# Altium schematic sheet DSP.SchDoc: DSP Interface
size 431 x 254 mm; Engineer: Prasoon Sinha; DocumentNumber: 2; SheetNumber: 2; SheetTotal: 26
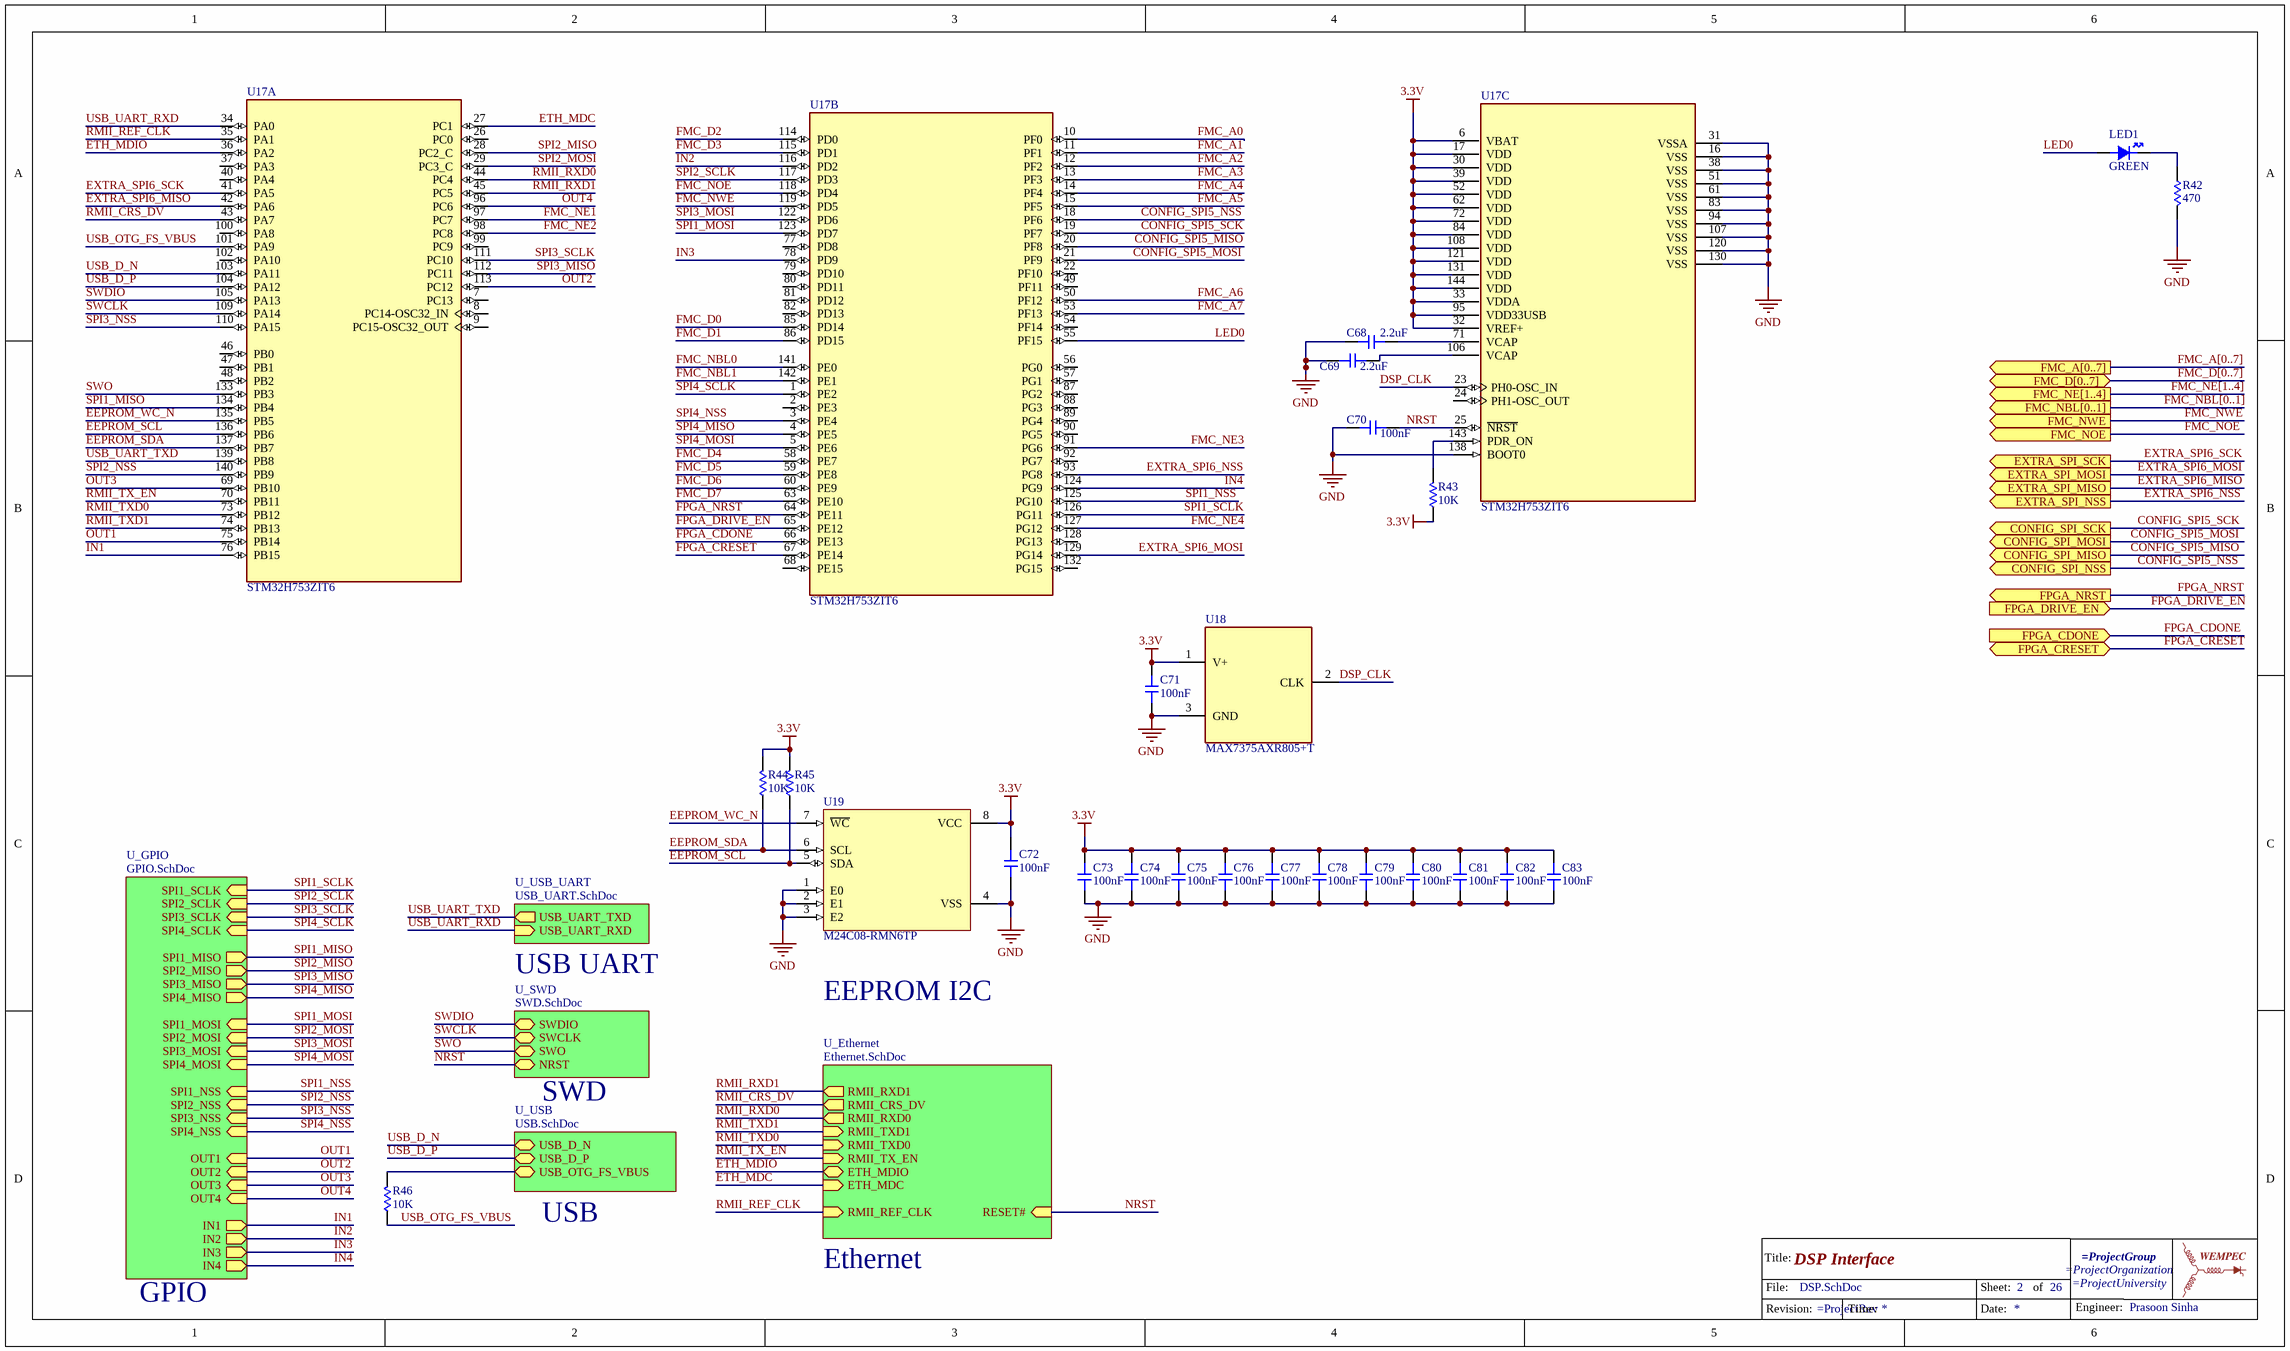
[diagram p0: DSP.SchDoc]

## Parts
*?  TitleBlockWEMPEC  (value not drawn)  (graphical)
C68  value 2.2uF  [0603-CAP]  (hidden comment: Capacitor)
C69  value 2.2uF  [0603-CAP]  (hidden comment: Capacitor)
C70  value 100nF  [0603-CAP]  (hidden comment: Capacitor)
C71  value 100nF  [0603-CAP]  (hidden comment: Capacitor)
C72  value 100nF  [0603-CAP]  (hidden comment: Capacitor)
C73  value 100nF  [0603-CAP]  (hidden comment: Capacitor)
C74  value 100nF  [0603-CAP]  (hidden comment: Capacitor)
C75  value 100nF  [0603-CAP]  (hidden comment: Capacitor)
C76  value 100nF  [0603-CAP]  (hidden comment: Capacitor)
C77  value 100nF  [0603-CAP]  (hidden comment: Capacitor)
C78  value 100nF  [0603-CAP]  (hidden comment: Capacitor)
C79  value 100nF  [0603-CAP]  (hidden comment: Capacitor)
C80  value 100nF  [0603-CAP]  (hidden comment: Capacitor)
C81  value 100nF  [0603-CAP]  (hidden comment: Capacitor)
C82  value 100nF  [0603-CAP]  (hidden comment: Capacitor)
C83  value 100nF  [0603-CAP]  (hidden comment: Capacitor)
LED1  value GREEN  [0603-LED]  (hidden comment: LED)
R42  value 470  [0603-RES]  (hidden comment: Resistor)
R43  value 10K  [0603-RES]  (hidden comment: Resistor)
R44  value 10K  [0603-RES]  (hidden comment: Resistor)
R45  value 10K  [0603-RES]  (hidden comment: Resistor)
R46  value 10K  [0603-RES]  (hidden comment: Resistor)
U17  STM32H753ZIT6  [QFP50P2200X2200X160-144N]  (parts A,B,C of 3)
U18  MAX7375AXR805+T  [SOT65P210X110-3N]
U19  M24C08-RMN6TP  [SOIC127P600X175-8N]

## Sub-sheets
U_Ethernet = Ethernet.SchDoc: RMII_RXD1 (out), RMII_CRS_DV (out), RMII_RXD0 (out), RMII_TXD1 (in), RMII_TXD0 (in), RMII_TX_EN (in), ETH_MDIO (bidir), ETH_MDC (in), RESET# (in), RMII_REF_CLK (in)
U_GPIO = GPIO.SchDoc: IN1 (out), IN3 (out), IN4 (out), OUT2 (in), OUT4 (in), OUT3 (in), OUT1 (in), IN2 (out), SPI4_MISO (out), SPI2_SCLK (in), SPI2_MISO (out), SPI1_SCLK (in), SPI1_MISO (out), SPI4_NSS (in), SPI2_NSS (in), SPI1_MOSI (in), SPI3_MOSI (in), SPI4_MOSI (in), SPI3_MISO (out), SPI3_SCLK (in), SPI1_NSS (in), SPI2_MOSI (in), SPI4_SCLK (in), SPI3_NSS (in)
U_SWD = SWD.SchDoc: NRST (bidir), SWO (bidir), SWCLK (bidir), SWDIO (bidir)
U_USB = USB.SchDoc: USB_D_N (bidir), USB_D_P (bidir), USB_OTG_FS_VBUS (bidir)
U_USB_UART = USB_UART.SchDoc: USB_UART_RXD (in), USB_UART_TXD (out)

## Ports
CONFIG_SPI_MISO (out), CONFIG_SPI_MOSI (out), CONFIG_SPI_NSS (out), CONFIG_SPI_SCK (out), EXTRA_SPI_MISO (out), EXTRA_SPI_MOSI (out), EXTRA_SPI_NSS (out), EXTRA_SPI_SCK (out), FMC_A[0..7] (out), FMC_D[0..7] (bidir), FMC_NBL[0..1] (out), FMC_NE[1..4] (out), FMC_NOE (out), FMC_NWE (out), FPGA_CDONE (in), FPGA_CRESET (bidir), FPGA_DRIVE_EN (in), FPGA_NRST (out)

## Nets
3.3V: C71.2 C72.2 C73.2 C74.2 C75.2 C76.2 C77.2 C78.2 C79.2 C80.2 C81.2 C82.2 C83.2 R43.1 R44.2 R45.2 U17.6(VBAT) U17.17(VDD) U17.30(VDD) U17.32(VREF+) U17.33(VDDA) U17.39(VDD) U17.52(VDD) U17.62(VDD) U17.72(VDD) U17.84(VDD) U17.95(VDD33USB) U17.108(VDD) U17.121(VDD) U17.131(VDD) U17.144(VDD) U18.1(V+) U19.8(VCC)
GND: C68.2 C69.2 C70.2 C71.1 C72.1 C73.1 C74.1 C75.1 C76.1 C77.1 C78.1 C79.1 C80.1 C81.1 C82.1 C83.1 R42.2 U17.16(VSS) U17.31(VSSA) U17.38(VSS) U17.51(VSS) U17.61(VSS) U17.83(VSS) U17.94(VSS) U17.107(VSS) U17.120(VSS) U17.130(VSS) U17.138(BOOT0) U18.3(GND) U19.1(E0) U19.2(E1) U19.3(E2) U19.4(VSS)
CONFIG_SPI5_MISO: U17.20(PF8) ; port CONFIG_SPI_MISO
CONFIG_SPI5_MOSI: U17.21(PF9) ; port CONFIG_SPI_MOSI
CONFIG_SPI5_NSS: U17.18(PF6) ; port CONFIG_SPI_NSS
CONFIG_SPI5_SCK: U17.19(PF7) ; port CONFIG_SPI_SCK
DSP_CLK: U17.23(PH0-OSC_IN) U18.2(CLK)
EEPROM_SCL: R45.1 U17.136(PB6) U19.5(SDA)
EEPROM_SDA: R44.1 U17.137(PB7) U19.6(SCL)
EEPROM_WC_N: U17.135(PB5) U19.7(~{WC})
ETH_MDC: U17.27(PC1) ; sheet U_Ethernet/ETH_MDC
ETH_MDIO: U17.36(PA2) ; sheet U_Ethernet/ETH_MDIO
EXTRA_SPI6_MISO: U17.42(PA6) ; port EXTRA_SPI_MISO
EXTRA_SPI6_MOSI: U17.129(PG14) ; port EXTRA_SPI_MOSI
EXTRA_SPI6_NSS: U17.93(PG8) ; port EXTRA_SPI_NSS
EXTRA_SPI6_SCK: U17.41(PA5) ; port EXTRA_SPI_SCK
FMC_A0: U17.10(PF0)
FMC_A1: U17.11(PF1)
FMC_A2: U17.12(PF2)
FMC_A3: U17.13(PF3)
FMC_A4: U17.14(PF4)
FMC_A5: U17.15(PF5)
FMC_A6: U17.50(PF12)
FMC_A7: U17.53(PF13)
FMC_D0: U17.85(PD14)
FMC_D1: U17.86(PD15)
FMC_D2: U17.114(PD0)
FMC_D3: U17.115(PD1)
FMC_D4: U17.58(PE7)
FMC_D5: U17.59(PE8)
FMC_D6: U17.60(PE9)
FMC_D7: U17.63(PE10)
FMC_NBL0: U17.141(PE0)
FMC_NBL1: U17.142(PE1)
FMC_NE1: U17.97(PC7)
FMC_NE2: U17.98(PC8)
FMC_NE3: U17.91(PG6)
FMC_NE4: U17.127(PG12)
FMC_NOE: U17.118(PD4) ; port FMC_NOE
FMC_NWE: U17.119(PD5) ; port FMC_NWE
FPGA_CDONE: U17.66(PE13) ; port FPGA_CDONE
FPGA_CRESET: U17.67(PE14) ; port FPGA_CRESET
FPGA_DRIVE_EN: U17.65(PE12) ; port FPGA_DRIVE_EN
FPGA_NRST: U17.64(PE11) ; port FPGA_NRST
IN1: U17.76(PB15) ; sheet U_GPIO/IN1
IN2: U17.116(PD2) ; sheet U_GPIO/IN2
IN3: U17.78(PD9) ; sheet U_GPIO/IN3
IN4: U17.124(PG9) ; sheet U_GPIO/IN4
LED0: LED1.A U17.55(PF15)
NRST: C70.1 U17.25(~{NRST}) ; sheet U_SWD/NRST, sheet U_Ethernet/RESET#
OUT1: U17.75(PB14) ; sheet U_GPIO/OUT1
OUT2: U17.113(PC12) ; sheet U_GPIO/OUT2
OUT3: U17.69(PB10) ; sheet U_GPIO/OUT3
OUT4: U17.96(PC6) ; sheet U_GPIO/OUT4
RMII_CRS_DV: U17.43(PA7) ; sheet U_Ethernet/RMII_CRS_DV
RMII_REF_CLK: U17.35(PA1) ; sheet U_Ethernet/RMII_REF_CLK
RMII_RXD0: U17.44(PC4) ; sheet U_Ethernet/RMII_RXD0
RMII_RXD1: U17.45(PC5) ; sheet U_Ethernet/RMII_RXD1
RMII_TX_EN: U17.70(PB11) ; sheet U_Ethernet/RMII_TX_EN
RMII_TXD0: U17.73(PB12) ; sheet U_Ethernet/RMII_TXD0
RMII_TXD1: U17.74(PB13) ; sheet U_Ethernet/RMII_TXD1
SPI1_MISO: U17.134(PB4) ; sheet U_GPIO/SPI1_MISO
SPI1_MOSI: U17.123(PD7) ; sheet U_GPIO/SPI1_MOSI
SPI1_NSS: U17.125(PG10) ; sheet U_GPIO/SPI1_NSS
SPI1_SCLK: U17.126(PG11) ; sheet U_GPIO/SPI1_SCLK
SPI2_MISO: U17.28(PC2_C) ; sheet U_GPIO/SPI2_MISO
SPI2_MOSI: U17.29(PC3_C) ; sheet U_GPIO/SPI2_MOSI
SPI2_NSS: U17.140(PB9) ; sheet U_GPIO/SPI2_NSS
SPI2_SCLK: U17.117(PD3) ; sheet U_GPIO/SPI2_SCLK
SPI3_MISO: U17.112(PC11) ; sheet U_GPIO/SPI3_MISO
SPI3_MOSI: U17.122(PD6) ; sheet U_GPIO/SPI3_MOSI
SPI3_NSS: U17.110(PA15) ; sheet U_GPIO/SPI3_NSS
SPI3_SCLK: U17.111(PC10) ; sheet U_GPIO/SPI3_SCLK
SPI4_MISO: U17.4(PE5) ; sheet U_GPIO/SPI4_MISO
SPI4_MOSI: U17.5(PE6) ; sheet U_GPIO/SPI4_MOSI
SPI4_NSS: U17.3(PE4) ; sheet U_GPIO/SPI4_NSS
SPI4_SCLK: U17.1(PE2) ; sheet U_GPIO/SPI4_SCLK
SWCLK: U17.109(PA14) ; sheet U_SWD/SWCLK
SWDIO: U17.105(PA13) ; sheet U_SWD/SWDIO
SWO: U17.133(PB3) ; sheet U_SWD/SWO
USB_D_N: U17.103(PA11) ; sheet U_USB/USB_D_N
USB_D_P: U17.104(PA12) ; sheet U_USB/USB_D_P
USB_OTG_FS_VBUS: R46.1 U17.101(PA9)
USB_UART_RXD: U17.34(PA0) ; sheet U_USB_UART/USB_UART_RXD
USB_UART_TXD: U17.139(PB8) ; sheet U_USB_UART/USB_UART_TXD
NetC68_1: C68.1 U17.71(VCAP)
NetC69_1: C69.1 U17.106(VCAP)
NetLED1_C: LED1.C R42.1
NetR43_2: R43.2 U17.143(PDR_ON)
NetR46_2: R46.2 ; sheet U_USB/USB_OTG_FS_VBUS

Not connected (* = marked no-connect by the designer): U17 2(PE3) 7(PC13) 8(PC14-OSC32_IN) 9(PC15-OSC32_OUT) 22(PF10) 24(PH1-OSC_OUT) 26(PC0) 37(PA3) 40(PA4) 46(PB0) 47(PB1) 48(PB2) 49(PF11) 54(PF14) 56(PG0) 57(PG1) 68(PE15) 77(PD8) 79(PD10) 80(PD11) 81(PD12) 82(PD13) 87(PG2) 88(PG3) 89(PG4) 90(PG5) 92(PG7) 99(PC9) 100(PA8) 102(PA10) 128(PG13) 132(PG15)

## Buses and harness runs
bus FMC_A[0..7] = port FMC_A[0..7]
bus FMC_D[0..7] = port FMC_D[0..7]
bus FMC_NBL[0..1] = port FMC_NBL[0..1]
bus FMC_NE[1..4] = port FMC_NE[1..4]

## Notes on the sheet
- USB UART
- EEPROM I2C
- SWD
- USB
- GPIO
- Ethernet
- (in symbol TitleBlockWEMPEC) Title:; File:; Sheet:; of; Engineer:; Revision:; Time:; Date:

## Library data of the parts
U17 = STM32H753ZIT6: DSP - LQFP 144 20X20X1.4 2; Supplier Part Number 1: 497-18568-ND
U18 = MAX7375AXR805+T: 8MHz XO (Standard) CMOS Oscillator 2.7V ~ 5.5V SC-70, SOT-323; Supplier Part Number 1: MAX7375AXR805+TCT-ND
U19 = M24C08-RMN6TP: EEPROM Memory IC 8Kb (1K x 8) I²C 400kHz 900ns 8-SO; Supplier Part Number 1: 497-8637-1-ND
C68-C83 = Capacitor: Supplier 1: Digi-Key
  C68 C69: Supplier Part Number 1: 490-12738-1-ND
  C70-C72: Supplier Part Number 1: 311-4055-1-ND
  C73-C83: Supplier Part Number 1: 1276-1012-1-ND
LED1 = LED: Supplier 1: Digi-Key; Supplier Part Number 1: 160-1446-1-ND
R42-R46 = Resistor: Supplier 1: Digi-Key
  R42: Supplier Part Number 1: 541-4038-1-ND
  R43-R46: Supplier Part Number 1: 541-5136-1-ND